# EAGLE design MiniDuino-v2 (EAGLE 6.5.0)
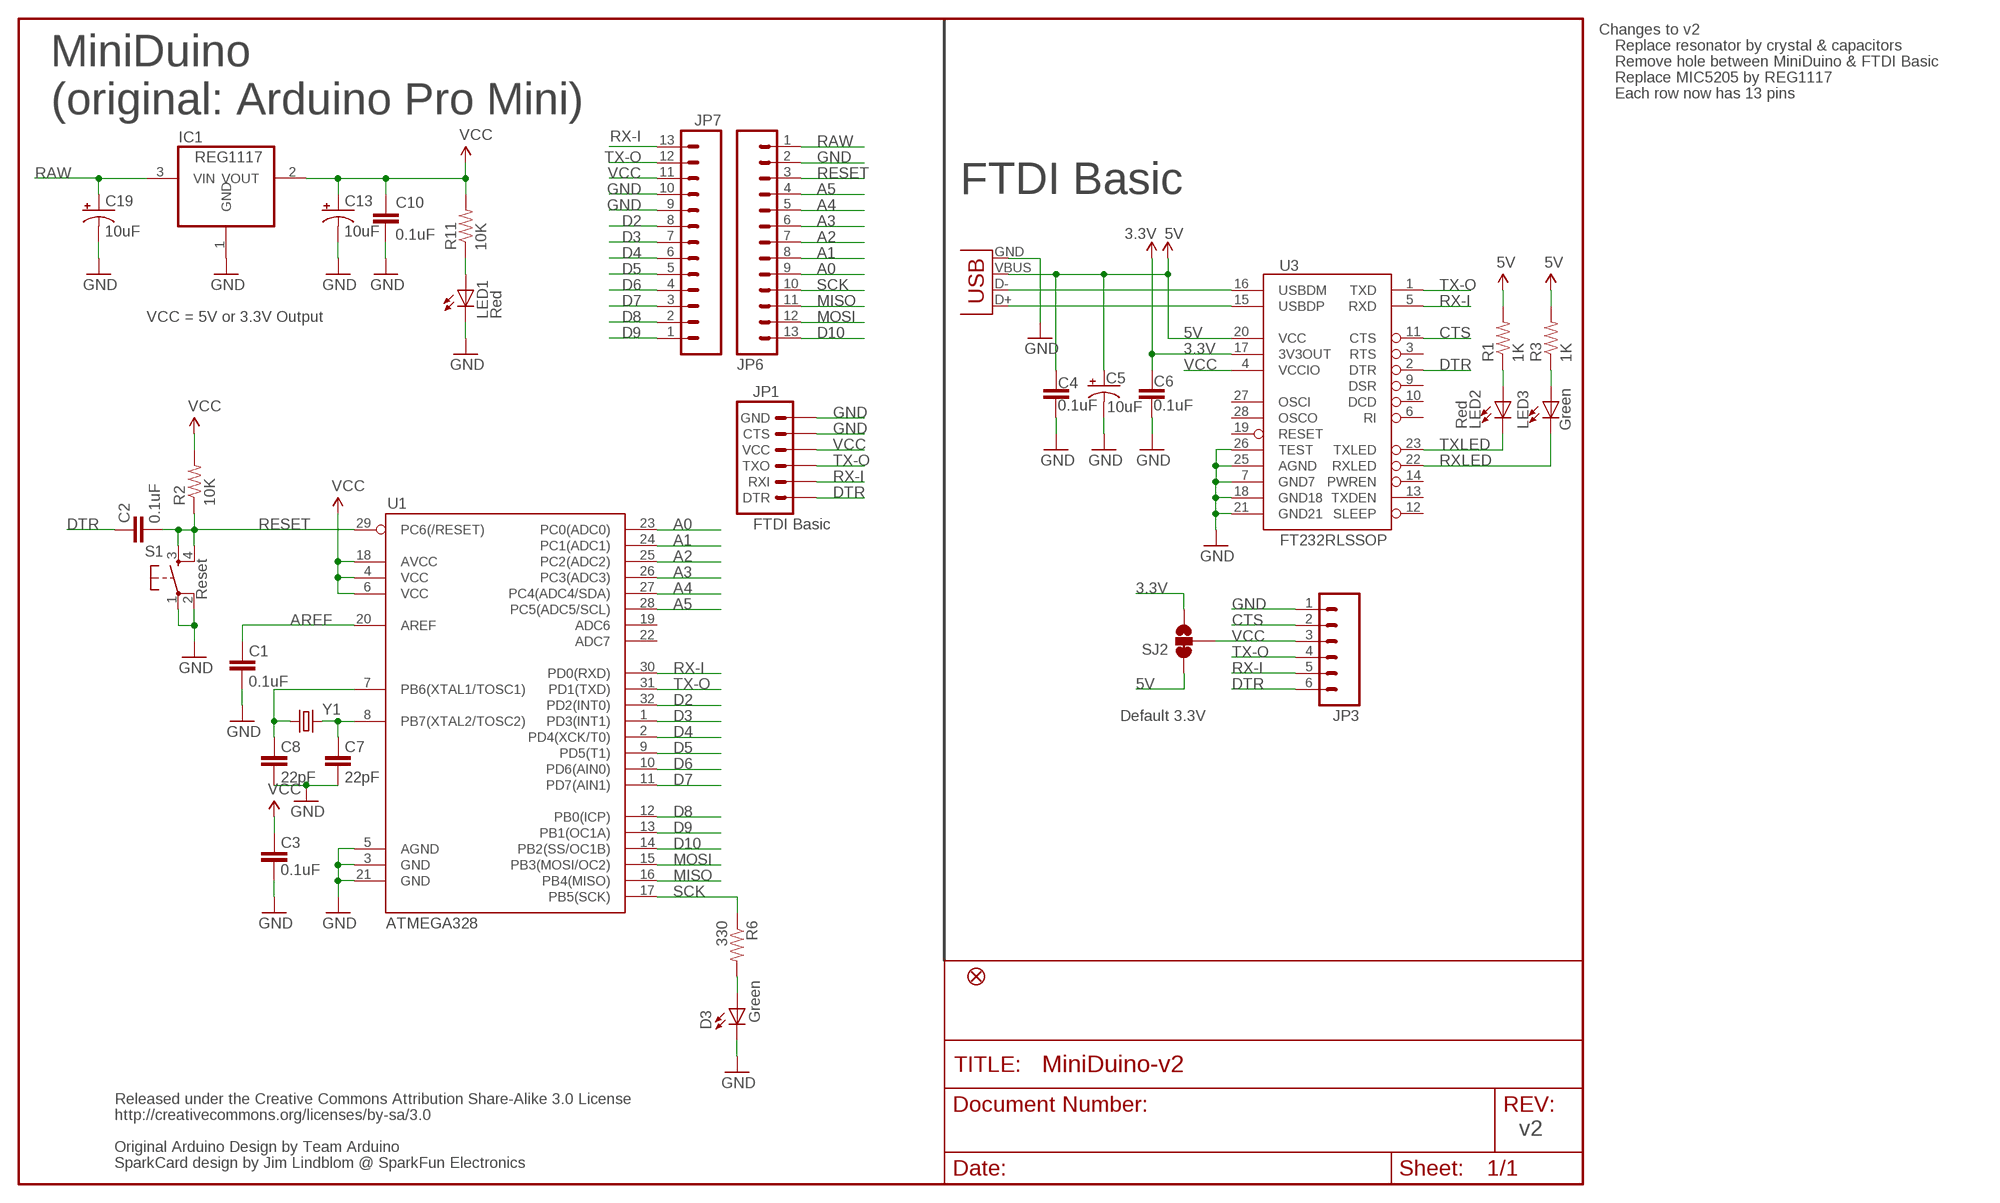
[diagram p0: schematic, sheet 1]

## Parts
C1  0.1uF  CAP0402-CAP  [0402-CAP]
C2  0.1uF  CAP0402-CAP  [0402-CAP]
C3  0.1uF  CAP0402-CAP  [0402-CAP]
C4  0.1uF  CAP0402-CAP  [0402-CAP]
C5  10uF  CAP_POL1206  [EIA3216]
C6  0.1uF  CAP0402-CAP  [0402-CAP]
C7  22pF  CAP0402-CAP  [0402-CAP]
C8  22pF  CAP0402-CAP  [0402-CAP]
C10  0.1uF  CAP0402-CAP  [0402-CAP]
C13  10uF  CAP_POL1206  [EIA3216]
C19  10uF  CAP_POL1206  [EIA3216]
D3  Green  LED0603  [LED-0603]
IC1  REG1117  [SOT223]
JP1  FTDI Basic  ARDUINO_SERIAL_PROGRAMPTH  [1X06]
JP3  M06SIP  [1X06]
JP6  M13  [1X13]
JP7  M13  [1X13]
JP16  FIDUCIAL1X2.5  [FIDUCIAL-1X2.5]
LED1  Red  LED0603  [LED-0603]
LED2  Red  LED0603  [LED-0603]
LED3  Green  LED0603  [LED-0603]
R1  1K  RESISTOR0603-RES  [0603-RES]
R2  10K  RESISTOR0402-RES  [0402-RES]
R3  1K  RESISTOR0603-RES  [0603-RES]
R6  330  RESISTOR0402-RES  [0402-RES]
R11  10K  RESISTOR0402-RES  [0402-RES]
S1  Reset  TAC_SWITCHSMD  [TACTILE_SWITCH_SMD]
SJ2  SOLDERJUMPER_2WAYS  [SJ_3]
U1  ATMEGA328  ATMEGA168  [TQFP32-08]
U3  FT232RLSSOP  [SSOP28DB]
X2  USB-SMD-NS  [USB-MINIB-NOSTOP]
Y1  CRYSTAL5X3  [CRYSTAL-SMD-5X3]

## Nets
3.3V [power]: C6.1 SJ2.3 U3.17(3V3OUT)
5V: C4.1 C5.A(+) R1.2 R3.2 SJ2.1 U3.20(VCC) X2.VBUS
A0: JP6.9 U1.23(PC0(ADC0))
A1: JP6.8 U1.24(PC1(ADC1))
A2: JP6.7 U1.25(PC2(ADC2))
A3: JP6.6 U1.26(PC3(ADC3))
A4: JP6.5 U1.27(PC4(ADC4/SDA))
A5: JP6.4 U1.28(PC5(ADC5/SCL))
AREF: C1.2 U1.20(AREF)
CTS: JP3.2 U3.11(CTS)
D2: JP7.8 U1.32(PD2(INT0))
D3: JP7.7 U1.1(PD3(INT1))
D4: JP7.6 U1.2(PD4(XCK/T0))
D5: JP7.5 U1.9(PD5(T1))
D6: JP7.4 U1.10(PD6(AIN0))
D7: JP7.3 U1.11(PD7(AIN1))
D8: JP7.2 U1.12(PB0(ICP))
D9: JP7.1 U1.13(PB1(OC1A))
D10: JP6.13 U1.14(PB2(SS/OC1B))
DTR: C2.2 JP1.1(DTR) JP3.6 U3.2(DTR)
GND [power]: C1.1 C3.1 C4.2 C5.C(-) C6.2 C7.1 C8.1 C10.2 C13.C(-) C19.C(-) D3.C IC1.1(GND) JP1.5(CTS) JP1.6(GND) JP3.1 JP6.2 JP7.9 JP7.10 LED1.C S1.1 S1.2 U1.3(GND) U1.5(AGND) U1.21(GND) U3.7(GND7) U3.18(GND18) U3.21(GND21) U3.25(AGND) U3.26(TEST) X2.GND
MISO: JP6.11 U1.16(PB4(MISO))
MOSI: JP6.12 U1.15(PB3(MOSI/OC2))
N$1: C7.2 U1.8(PB7(XTAL2/TOSC2)) Y1.3
N$2: C8.2 U1.7(PB6(XTAL1/TOSC1)) Y1.1
N$3: LED2.A R1.1
N$4: LED3.A R3.1
N$7: D3.A R6.2
N$38: LED1.A R11.1
RAW [power]: C19.A(+) IC1.3(VIN) JP6.1
RESET: C2.1 JP6.3 R2.1 S1.3 S1.4 U1.29(PC6(/RESET))
RX-I: JP1.2(RXI) JP3.5 JP7.13 U1.30(PD0(RXD)) U3.5(RXD)
RXLED: LED3.C U3.22(RXLED)
SCK: JP6.10 R6.1 U1.17(PB5(SCK))
TX-O: JP1.3(TXO) JP3.4 JP7.12 U1.31(PD1(TXD)) U3.1(TXD)
TXLED: LED2.C U3.23(TXLED)
USB_D+: U3.15(USBDP) X2.D+
USB_D-: U3.16(USBDM) X2.D-
VCC: C3.2 C10.1 C13.A(+) IC1.2(VOUT) JP1.4(VCC) JP3.3 JP7.11 R2.2 R11.2 SJ2.2 U1.4(VCC) U1.6(VCC) U1.18(AVCC) U3.4(VCCIO)
Unconnected: U1.19(ADC6) U1.22(ADC7) U3.3(RTS) U3.6(RI) U3.9(DSR) U3.10(DCD) U3.12(SLEEP) U3.13(TXDEN) U3.14(PWREN) U3.19(RESET) U3.27(OSCI) U3.28(OSCO)

## Notes on the sheet
- Changes to v2
- Replace resonator by crystal & capacitors
- Remove hole between MiniDuino & FTDI Basic
- Replace MIC5205 by REG1117
- Each row now has 13 pins
- MiniDuino
  (original: Arduino Pro Mini)
- FTDI Basic
- VCC = 5V or 3.3V Output
- Default 3.3V
- Released under the Creative Commons Attribution Share-Alike 3.0 License
- http://creativecommons.org/licenses/by-sa/3.0
- v2
- Original Arduino Design by Team Arduino
- SparkCard design by Jim Lindblom @ SparkFun Electronics

## Library data of the parts
C1-C4 C6-C8 C10 = SparkFun:CAP: Capacitor Standard 0603 ceramic capacitor, and 0.1" leaded capacitor.
C5 C13 C19 = SparkFun:CAP_POL: Capacitor Polarized These are standard SMD and PTH capacitors. Normally 10uF, 47uF, and 100uF in electrolytic and tantalum varieties. Always verify the external diameter of the through hole cap, it varies with capacity, voltage, and manufacturer. The EIA devices should be standard.
D3 LED1-LED3 = SparkFun:LED: LEDs Standard schematic elements and footprints for 5mm, 3mm, 1206, and 0603 sized LEDs. 5mm - Spark Fun Electronics SKU : COM-00529 (and others)
IC1 = burr-brown:REG1117: 800mA and 1A Low Dropout (LDO) Positive Regulator 1.8V, 2.5V, 2.85V, 3.3V, 5V, and Adj; MPN: REG1117; OC_FARNELL: 1097566; OC_NEWARK: 14P6981
JP1 = SparkFun:ARDUINO_SERIAL_PROGRAM
JP3 = SparkFun:M06: Header 6 Standard 6-pin 0.1" header. Use with straight break away headers (SKU : PRT-00116), right angle break away headers (PRT-00553), swiss pins (PRT-00743), machine pins (PRT-00117), and female headers (PRT-00115). Molex polarized connector foot print use with SKU : PRT-08094 with associated crimp pins and housings. NOTES ON THE VARIANTS LOCK and LOCK_LONGPADS... This footprint was designed to help hold the alignment of a through-hole component (i.e. 6-pin header) while soldering it into place. You may notice that each hole has been shifted either up or down by 0.005 of an inch from it's more standard position (which is a perfectly straight line). This slight alteration caused the pins (the squares in the middle) to touch the edges of the holes. Because they are alternating, it causes a "brace" to hold the component in place. 0.005 has proven to be the perfect amount of "off-center" position when using our standard breakaway headers. Although looks a little odd when you look at the bare footprint, once you have a header in there, the alteration is very hard to notice. Also, if you push a header all the way into place, it is covered up entirely on the bottom side. This idea of altering the position of holes to aid alignment will be further integrated into the Sparkfun Library for other footprints. It can help hold any component with 3 or more connection pins.
JP6 JP7 = SparkFun-Connectors:M13: 13-pin single row .1" header
JP16 = abes:FIDUCIAL: Fiducial Alignment Points Various fiducial points for machine vision alignment.
R1-R3 R6 R11 = SparkFun:RESISTOR: Resistor Basic schematic elements and footprints for 0603, 1206, and PTH resistors.
S1 = SparkFun:TAC_SWITCH: Momentary Switch Button commonly used for reset or general input. Spark Fun Electronics SKU : COM-00097
SJ2 = SparkFun:SOLDERJUMPER_2WAY: Solder Jumper 2 way solder jumper
U1 = SparkFun:ATMEGA168
U3 = SparkFun:FT232RL: USB UART FT232RL 4th Generation USB UART (USB <-> Serial) Controller. Spark Fun Electronics SKU : COM-00650
X2 = SparkFun:USB: USB Connectors USB-B-PTH is fully proven SKU : PRT-00139 USB-miniB is fully proven SKU : PRT-00587 USB-A-PCB is untested. USB-A-H is throughly reviewed, but untested. Spark Fun Electronics SKU : PRT-00437 USB-B-SMT is throughly reviewed, but untested. Needs silkscreen touching up. USB-A-S has not been used/tested USB-MB-H has not been used/tested
Y1 = SparkFun-FreqCtrl:CRYSTAL: Various standard crystals. Proven footprints. Spark Fun Electronics SKU : COM-00534

## Net classes
0 default: width 0.203 mm
1 power: width 0.254 mm

## Board
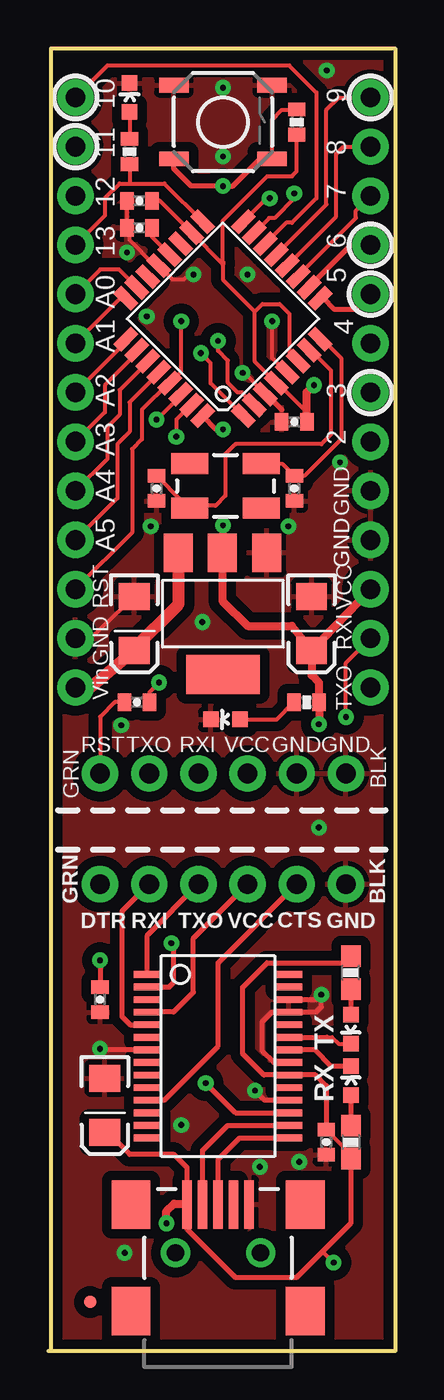
[diagram p1: board, top side]
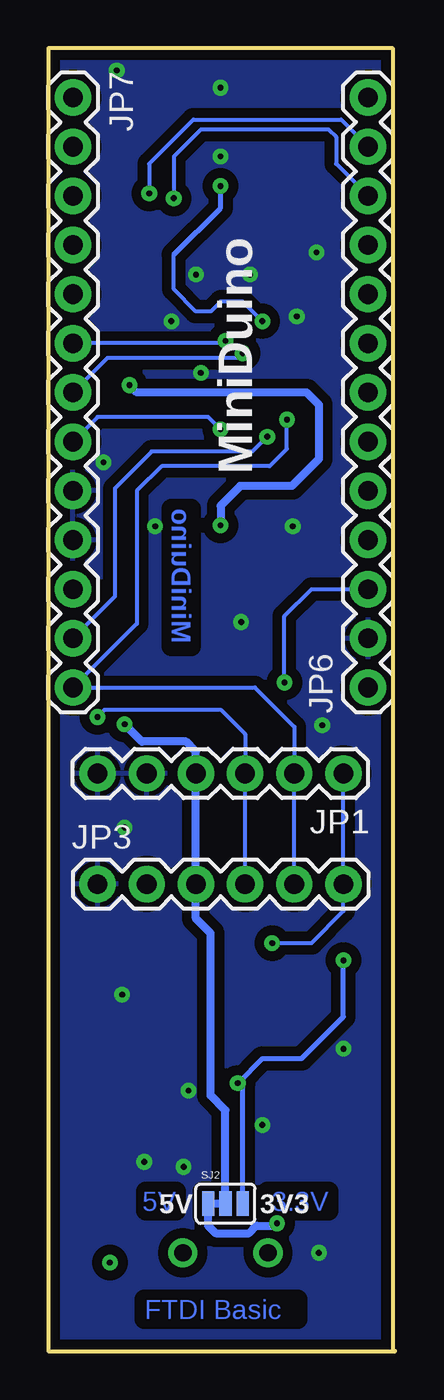
[diagram p2: board, bottom side, seen from below]

Size 17.91 x 67.31 mm. Coordinates in mm from the lower left corner, seen from the top.
Outline: 0.13,0 0.13,67.31 17.91,67.31 17.91,0 0,0
Copper layers (1*16): Top 0.035mm / dielectric 1.5mm / Bottom 0.035mm
Design rules "SparkFun *": minimum track width 8mil, minimum drill 20mil, track to track 8mil, track to pad 8mil, pad to pad 8mil, via to via 8mil, smd to smd 8mil, copper to edge 8mil, drill to drill 8mil, minimum pad ring 12mil, minimum via ring 10mil, stop-mask expansion 4mil, vias tented up to drill 20mil, thermal gap 10mil

### Footprints (pad centres in the part's own frame; a part is rotated, then mirrored left to right if it is on the bottom)
0402-CAP = smd 0.7 x 0.9: 1 -0.65,0; 2 0.65,0
EIA3216 = smd 1.4 x 1.6: A 1.4,0; C -1.4,0
LED-0603 = smd 0.8 x 0.8: A 0,-0.75; C 0,0.75
SOT223 = smd 1.499 x 2.007: 1 -2.261,-3.15; 2 0.025,-3.15; 3 2.311,-3.15 | smd 3.81 x 2.007: 4 0,3.15
1X06 = drill 1.016 pad 1.88: 1 0,0; 2 2.54,0; 3 5.08,0; 4 7.62,0; 5 10.16,0; 6 12.7,0
1X13 = drill 1.016 pad 1.88: 1 0,0; 2 2.54,0; 3 5.08,0; 4 7.62,0; 5 10.16,0; 6 12.7,0; 7 15.24,0; 8 17.78,0; 9 20.32,0; 10 22.86,0; 11 25.4,0; 12 27.94,0; 13 30.48,0
FIDUCIAL-1X2.5 = smd 0.635 x 0.635: 1 0,0
0603-RES = smd 1.1 x 1: 1 -0.85,0; 2 0.85,0
0402-RES = smd 0.7 x 0.9: 1 -0.65,0; 2 0.65,0
TACTILE_SWITCH_SMD = smd 1.524 x 0.762: 1 -2.54,1.905; 2 2.54,1.905; 3 -2.54,-1.905; 4 2.54,-1.905
SJ_3 = smd 0.635 x 1.27: 1 -0.889,0; 2 0,0; 3 0.889,0
TQFP32-08 = smd 1.27 x 0.559: 1 -4.293,2.8; 2 -4.293,2; 3 -4.293,1.2; 4 -4.293,0.4; 5 -4.293,-0.4; 6 -4.293,-1.2; 7 -4.293,-2; 8 -4.293,-2.8; 17 4.293,-2.8; 18 4.293,-2; 19 4.293,-1.2; 20 4.293,-0.4; 21 4.293,0.4; 22 4.293,1.2; 23 4.293,2; 24 4.293,2.8 | smd 0.559 x 1.27: 9 -2.8,-4.293; 10 -2,-4.293; 11 -1.2,-4.293; 12 -0.4,-4.293; 13 0.4,-4.293; 14 1.2,-4.293; 15 2,-4.293; 16 2.8,-4.293; 25 2.8,4.293; 26 2,4.293; 27 1.2,4.293; 28 0.4,4.293; 29 -0.4,4.293; 30 -1.2,4.293; 31 -2,4.293; 32 -2.8,4.293
SSOP28DB = smd 0.348 x 1.397: 1 -4.225,-3.656; 2 -3.575,-3.656; 3 -2.925,-3.656; 4 -2.275,-3.656; 5 -1.625,-3.656; 6 -0.975,-3.656; 7 -0.325,-3.656; 8 0.325,-3.656; 9 0.975,-3.656; 10 1.625,-3.656; 11 2.275,-3.656; 12 2.925,-3.656; 13 3.575,-3.656; 14 4.225,-3.656; 15 4.225,3.656; 16 3.575,3.656; 17 2.925,3.656; 18 2.275,3.656; 19 1.625,3.656; 20 0.975,3.656; 21 0.325,3.656; 22 -0.325,3.656; 23 -0.975,3.656; 24 -1.625,3.656; 25 -2.275,3.656; 26 -2.925,3.656; 27 -3.575,3.656; 28 -4.225,3.656
USB-MINIB-NOSTOP = smd 2.5 x 0.5: D+ 2.5,0; D- 2.5,0.8; GND 2.5,-1.6; ID 2.5,-0.8; VBUS 2.5,1.6 | smd 2.5 x 2: G1 -3,-4.5; G2 -3,4.5; G3 2.5,4.5; G4 2.5,-4.5 | drill 0.9 pad 0.8: H1 0,2.2 | drill 0.9 pad 0.787: H2 0,-2.2
CRYSTAL-SMD-5X3 = smd 1.9 x 1.1: 1 -1.85,-1.15; 2 1.85,-1.15; 3 1.85,1.15; 4 -1.85,1.15

### Placement (x,y rotation side)
C1  4.7,58.04 0 top
C2  4.57,33.53 180 top
C3  4.7,59.44 0 top
C4  14.35,10.79 270 top
C5  2.92,12.7 270 top
C6  2.67,18.16 270 top
C7  12.7,44.58 90 top
C8  5.59,44.58 90 top
C10  12.7,48.01 180 top
C13  13.59,37.59 270 top
C19  4.44,37.59 270 top
D3  4.19,64.77 0 top
IC1  9.02,38.1 180 top
JP1  2.67,29.84 180 bottom
JP3  15.37,24.13 0 bottom
JP6  1.4,34.29 90 bottom
JP7  16.64,64.77 270 bottom
JP16  2.16,2.54 0 top
LED1  9.14,32.64 90 top
LED2  15.62,16.64 180 top
LED3  15.62,13.97 0 top
R1  15.62,19.56 90 top
R2  12.83,63.5 270 top
R3  15.62,10.79 270 top
R6  4.19,61.98 90 top
R11  13.34,33.53 0 top
S1  9.02,63.5 0 top
SJ2  8.76,7.62 0 bottom
U1  9.02,53.34 135 top
U3  8.76,15.24 270 top
X2  8.76,5.08 90 top
Y1  9.14,44.7 0 top

### Tracks (layer width: path | path; a pad name or v marks a point on that pad's centre or on a via)
3.3V  (via drill 0.3)
  Top 0.254: U3.17 9.66,12.31 v8.13,13.84 | v2.67,20.19 C6.1
  Bottom 0.254: SJ2.3 7.87,13.59 v8.13,13.84 6.86,15.11 4.83,15.11 2.67,17.27 v2.67,20.19
5V  (via drill 0.3)
  Top 0.203: v14.73,4.57 14.22,5.08 14.22,5.21 | R3.2 15.62,10.18 C4.1
  Top 0.254: C5.A 3.05,11.3 4.19,10.16 6.48,10.16 7.16,9.47 X2.VBUS | X2.VBUS 7.16,6.3 9.65,3.81 12.83,3.81 14.22,5.21 15.62,6.6 R3.2 | 7.12,7.62 X2.VBUS | 14.35,11.21 C4.1 14.35,13.72 13.8,14.27 U3.20 11.13,14.27 10.03,15.37 10.03,18.8 11.3,20.07 15.28,20.07 R1.2
  Top 0.406: v6.1,6.6 6.1,7.24 6.48,7.62 7.12,7.62
  Bottom 0.203: 6.22,6.48 v6.1,6.6
  Bottom 0.254: SJ2.1 9.53,7.62
  Bottom 0.406: 6.22,6.48 7.16,6.48 7.54,6.1 9.27,6.1 9.65,6.48 SJ2.1 | 8.76,7.62 9.53,7.62
A0
  Top 0.203: U1.23 3.65,55.88 2.67,55.88 JP6.9
A1
  Top 0.203: 1.38,52.08 JP6.8 3.72,54.4
  Top 0.254: U1.24 3.72,54.4
A2
  Top 0.203: 4,52.13 JP6.7
  Top 0.254: U1.25 4,52.13
A3
  Top 0.203: 4.57,51.56 2.92,49.91 2.92,48.51 JP6.6
  Top 0.254: U1.26 4.57,51.56
A4
  Top 0.203: U1.27 5.13,51.11 3.68,49.66 3.68,48.39 3.05,47.75 3.05,46.1 JP6.5
A5
  Top 0.203: U1.28 5.7,50.53 4.19,49.02 4.19,47.5 3.56,46.86 3.56,44.07 JP6.4
AREF
  Top 0.203: C1.2 5.35,57.57 U1.20
CTS
  Top 0.254: U3.11 5.98,12.96 8.76,15.75 8.76,20.07 JP3.2
D2  (via drill 0.3)
  Top 0.254: v9.02,47.62 8.66,47.62 U1.32
  Bottom 0.203: JP7.8 15.37,48.26 9.65,48.26 v9.02,47.62
D3  (via drill 0.3)
  Top 0.203: U1.1 8.38,50.02 8.38,51.05 v7.87,51.56
  Bottom 0.203: JP7.7 14.86,51.31 8.13,51.31 v7.87,51.56
D4  (via drill 0.3)
  Top 0.203: v8.76,52.2 8.76,51.69 9.27,51.18 9.27,50.04 9.78,49.53 10,49.53 U1.2
  Bottom 0.203: v8.76,52.2 8.89,52.07 JP7.6
D5
  Top 0.254: U1.9 14.19,54.4 14.73,53.85 15.88,53.85 JP7.5
D6
  Top 0.254: U1.10 13.47,55 15.62,57.15 JP7.4
D7
  Top 0.203: 12.9,55.57 15.88,58.55 15.88,58.93 JP7.3
  Top 0.254: U1.11 12.9,55.57
D8
  Top 0.203: U1.12 14.86,58.62 14.86,61.85 15.24,62.23 JP7.2
D9
  Top 0.203: U1.13 14.35,59.24 14.35,64.14 14.99,64.77 JP7.1
D10
  Top 0.203: U1.14 12.27,58.29 12.57,58.29 13.84,59.56 13.84,65.02 12.45,66.42 3.05,66.42 JP6.13
DTR  (via drill 0.3)
  Top 0.203: C2.2 3.43,33.53 2.67,32.77 JP1.1
  Top 0.254: U3.2 6.24,18.82 6.48,19.05 6.48,20.95 v6.35,21.08
  Bottom 0.203: 2.67,30.35 JP1.1 JP3.6 2.67,22.73 4.32,21.08 v6.35,21.08
GND  (via drill 0.3)
  Top 0.203: 7.24,55.63 6.98,55.37 6.42,55.37 U1.21 | 12.28,50.59 11.56,51.31 v11.56,53.21 | 5.5,56.09 4.19,57.4 4.19,57.9 | 13.07,17.53 13.08,17.52 | C3.1 C1.1 | JP6.2 2.16,36.83 C19.C 3.92,39.52 | 11.25,49.46 U1.3 10.03,50.63 v10.03,50.55
  Top 0.254: C3.1 3.94,59.44 | 3.94,57.85 3.94,58.04 C1.1 4.19,57.9 | U3.7 2.72,15.56 v2.67,15.62 | U3.26 13.85,18.16 v14.1,18.41 14.1,17.78 13.83,17.52 13.08,17.52 U3.25 | U3.18 11.17,12.96 v10.67,13.46 | v7.49,55.63 7.24,55.63 | U1.5 12.28,50.59 | U1.3 11.12,49.46 | U1.21 5.5,56.09 | U3.21 11.63,14.91 11.05,15.49 11.05,17.02 11.56,17.53 13.07,17.53 | 11.25,49.46 12.07,48.64 | 12.07,48.02 C10.2
  other vias: 9.02,65.28 15.06,45.92 3.94,5.08 10.92,9.53 12.95,9.78 6.86,11.68 13.97,27.05 9.02,61.72 14.38,66.17 10.29,55.63 5.28,42.62 5.08,53.47 12.4,42.62 7.95,37.67 3.76,32.33 4.06,56.77
  pour Bottom (isolate 0.508): 0.13,67.31 0.13,0 17.91,0 17.91,67.31
  pour Top (isolate 0.508): 0.13,67.31 0.13,0 17.91,0 17.91,67.31
MISO  (via drill 0.3)
  Top 0.203: U1.16 11.28,59.56 v11.43,59.56
  Bottom 0.203: v11.43,59.56 11.43,61.72 10.03,63.12 3.43,63.12 3.05,62.74 3.05,61.34 JP6.11
MOSI  (via drill 0.3)
  Top 0.203: U1.15 11.4,58.55 11.68,58.55 12.7,59.56
  Top 0.254: v12.7,59.82 12.7,59.56
  Bottom 0.203: v12.7,59.82 12.7,61.34 10.41,63.63 2.79,63.63 JP6.12
N$1
  Top 0.203: 14.14,52.28 15.11,51.31 15.11,47.12 13.21,45.21 12.71,45.21 C7.2 12.07,45.85 Y1.3
  Top 0.254: U1.8 14.14,52.28
N$2
  Top 0.203: 13.56,51.72 14.61,50.67 14.61,47.37 14.1,46.86 9.65,46.86 9.14,46.35 9.14,44.2 8.64,43.69 7.43,43.69 Y1.1 6.92,43.93 6.89,43.93 C8.2
  Top 0.254: U1.7 13.56,51.72
N$3
  Top 0.254: R1.1 LED2.A
N$4
  Top 0.254: LED3.A R3.1
N$7
  Top 0.203: D3.A R6.2
N$38
  Top 0.203: LED1.A 11.8,32.64 R11.1
RAW
  Top 0.203: C19.A 4.31,36.19 | 6.73,41.22 IC1.3 6.68,41.27
  Top 0.61: JP6.1 2.16,34.29 C19.A | 4.31,36.19 6.73,38.61 6.73,41.22
RESET  (via drill 0.3)
  Top 0.203: 12.81,64.14 12.07,64.14 11.56,63.63 S1.4 | v6.86,53.21 6.86,50.62 U1.29 6.21,50.02 4.83,48.64 4.83,47.12 4.32,46.61 4.32,42.29 JP6.3 | C2.1 5.22,34.05 v5.71,34.54
  Top 0.254: 12.81,64.14 R2.1 | S1.3 6.48,61.09 7.37,60.2 v9.02,60.2 9.53,60.2 10.92,61.59 S1.4
  Bottom 0.203: 11.43,56.64 11.43,54.86 10.29,53.72 9.53,53.72 9.02,54.23 7.87,54.23 v6.86,53.21 6.73,53.21 | v5.71,34.54 5.71,37.97 4.32,39.37 JP6.3
  Bottom 0.254: 11.43,56.64 9.02,59.05 v9.02,60.2
RX-I  (via drill 0.3)
  Top 0.203: U1.30 6.83,49.38 v5.59,48.13
  Top 0.254: U3.5 4.22,16.86 3.81,17.27 3.81,22.73 JP3.5
  Bottom 0.203: v5.59,48.13 5.59,46.61 6.48,45.72 12.07,45.72 13.34,44.45 13.34,37.59 JP7.13 7.24,34.29 5.21,32.26 JP1.2 JP3.5
RXLED
  Top 0.254: U3.22 13.77,15.56 14.62,14.72 LED3.C
SCK
  Top 0.203: 4.19,60.33 3.68,60.33 2.92,59.56 2.92,58.67 JP6.10 | 4.19,60.33 5.99,60.33 U1.17 | R6.1 4.19,60.33
TX-O  (via drill 0.3)
  Top 0.203: U1.31 7.36,48.89 6.6,48.13 v6.6,47.24 | JP7.12 15.37,35.56 v15.37,32.77
  Top 0.254: U3.1 5.11,21.49 JP3.4
  Bottom 0.203: v6.6,47.24 7.37,46.48 12.57,46.48 14.48,44.58 14.48,38.99 JP7.12 | v15.37,32.77 14.99,33.15 9.02,33.15 7.75,31.88 JP1.3 JP3.4
TXLED
  Top 0.203: 14.39,16.21 14.65,16.21 14.99,15.88 15.61,15.88 LED2.C
  Top 0.254: U3.23 14.39,16.21
USB_D+
  Top 0.254: X2.D+ 8.76,9.91 9.87,11.02 U3.15
USB_D-
  Top 0.254: U3.16 9.25,11.66 7.96,10.38 X2.D-
VCC  (via drill 0.3)
  Top 0.203: R2.2 12.83,60.96 12.57,60.71 11.3,60.71 9.02,58.42 9.02,56.26 | 5.75,59.44 C3.2 | 10.67,53.72 11.05,54.1 11.94,54.1 12.45,53.59 12.45,51.61 U1.6 | 5.75,59.44 | 5.75,59.44 U1.18 9.02,56.17 9.02,55.37 10.67,53.72 | 10.67,53.72 10.67,51.12 U1.4 | 13.97,33.51 R11.2 13.97,33.54 | 11.77,49.95 11.9,49.95 13.34,48.51 13.34,48.02 C10.1 | 9.02,41.27 IC1.2
  Top 0.254: 9.02,56.17 8.97,56.22 9.02,56.26 9.02,56.17 | C3.2 5.21,59.44 | 11.79,50.02 U1.4 11.77,49.95 | U3.4 6.47,17.52 7.49,18.54 7.49,21.34 JP3.3
  Top 0.406: IC1.2 8.99,38.76 10.29,37.47 12.57,37.47 C13.A | C13.A JP7.11 | C13.A 13.59,34.92 13.97,34.54 13.97,33.54 | 13.34,48.51 13.34,49.53 v13.72,49.91 | v9.02,42.67 9.02,41.27 | R11.2 13.99,32.4 v13.97,32.38
  Bottom 0.406: SJ2.2 8.76,12.45 9.53,13.21 9.53,21.59 10.29,22.35 JP3.3 JP1.4 10.29,30.99 10.79,31.5 13.08,31.5 v13.97,32.38 | v9.02,42.67 9.02,43.69 8,44.7 5.33,44.7 3.94,46.1 3.94,48.9 4.57,49.53 13.34,49.53 v13.72,49.91

### Text on the board
Bottom: MiniDuino | 3.3V | 5V | FTDI Basic
tPlace: 10 | 9 | 11 | 8 | 12 | 7 | 13 | 6 | A0 | 5 | A1 | 4 | A2 | 3 | A3 | 2 | A4 | GND | A5 | GND | GND | RST | VCC | GND | RXI | Vin | TXO | RST | TXO | RXI | VCC | GND | GND | GRN | BLK | GRN | BLK | DTR | RXI | TXO | VCC | CTS | GND | TX | RX
bPlace: MiniDuino | 3V3 | 5V